# Altium schematic sheet Componets.SchDoc
size A3; SheetNumber: 11; SheetTotal: 11
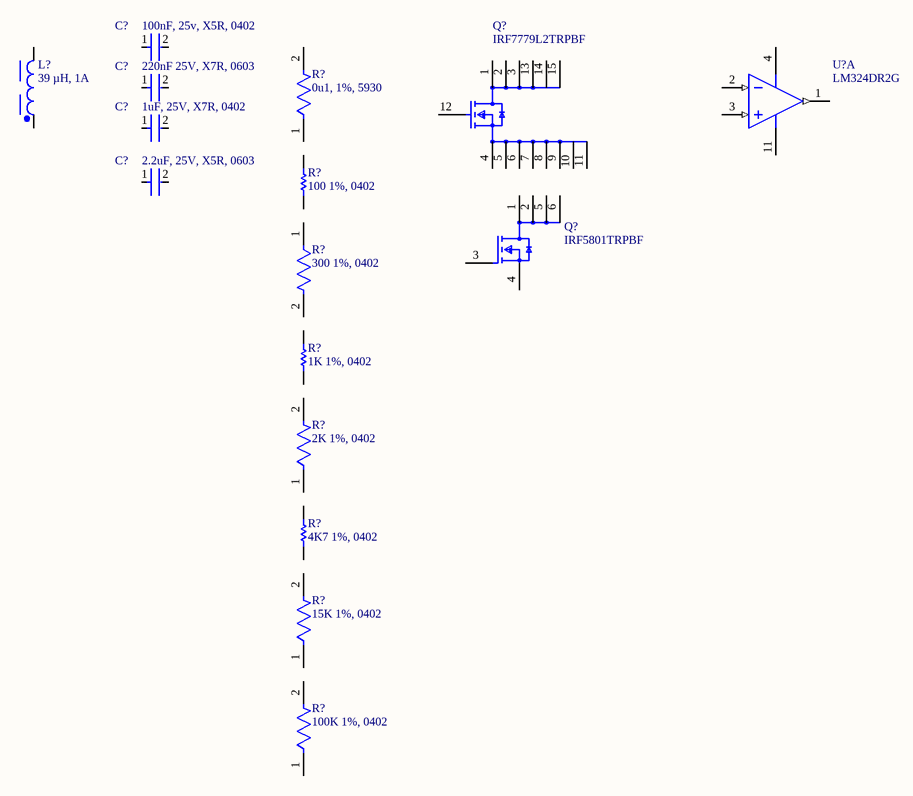
[diagram p0: Componets.SchDoc]

## Parts
(Parts that share a designator on the sheet are numbered #1, #2 ... from top to bottom, then left to right.)
C?#1  100nF, 25v, X5R, 0402  [FP-GRM155-0_05-IPC_C]
C?#2  220nF 25V, X7R, 0603  [FP-GCM188-0_1-IPC_B]
C?#3  1uF, 25V, X7R, 0402  [FP-GRM155-0_05-IPC_B]
C?#4  2.2uF, 25V, X5R, 0603  [FP-GRM188-0_1-e0_2_0_5-MFG]
L?  39 µH, 1A  [WE-PD_7345]
Q?#1  IRF7779L2TRPBF  [FP-MG-WDSON-11-MFG]
Q?#2  IRF5801TRPBF  [FP-PG-TSOP-6-MFG]
R?#1  0u1, 1%, 5930  [FP-CSS2H-5930K-1L00F-MFG]
R?#2  100 1%, 0402  [RESC1005X40X25LL05T05]
R?#3  300 1%, 0402  [FP-ERJ2RK-IPC_A]
R?#4  1K 1%, 0402  [RESC1005X40X25NL05T05]
R?#5  2K 1%, 0402  [FP-ERJ2RK-MFG]
R?#6  4K7 1%, 0402  [RESC1005X40X25LL05T05]
R?#7  15K 1%, 0402  [FP-ERJ2R-MFG]
R?#8  100K 1%, 0402  [FP-ERJ2RK-IPC_C]
U?  LM324DR2G  [ONSC-SOIC-14-751A-03_V]  (part A of 4)

## Nets

Not connected (* = marked no-connect by the designer): C?#1 1 2; C?#2 1 2; C?#3 1 2; C?#4 1 2; L? 1 2; Q?#1 1(Drain) 2(Drain) 3(Drain) 4(Source) 5(Source) 6(Source) 7(Source) 8(Source) 9(Source) 10(Source) 11(Source) 12(Gate) 13(Drain) 14(Drain) 15(Drain); Q?#2 1(D) 2(D) 3(G) 4(S) 5(D) 6(D); R?#1 1 2; R?#2 1 2; R?#3 1 2; R?#4 1 2; R?#5 1 2; R?#6 1 2; R?#7 1 2; R?#8 1 2; U? 1(OUT1) 2(IN1-) 3(IN1+) 4(VCC) 11(VEE/GND)

## Library data of the parts
C?#1 = CMP-06035-003661-1: Chip Multilayer Ceramic Capacitors for General Purpose, 0402, 0.10uF, X7R, 15%, 10%, 25V; Length: 1mm; Depth: 0.5mm; Dielectric: X7R; Voltage Rating: 25V; Lead Free: Lead Free; Case Code (Imperial): 0402; Voltage: 25V; Min Operating Temperature: -55°C; Tolerance: 10%; Dielectric Material: Ceramic; Voltage Rating (DC): 25V; Max Operating Temperature: 125°C; Capacitance: 100nF; Thickness: 0.022inch; Case/Package: 0402; Height: 0.5mm; Resistor Type: Ceramic; Weight: 0.000212oz; Case Code (Metric): 1005; Package Quantity: 10000; Termination: SMD/SMT; Width: 0.02inch; Mount: Surface Mount; Packaging: Tape and Reel
C?#2 = CMP-2006-02366-2: Ceramic Capacitor for Automotive 220nF  ±10% 25VDC X7R 0603 Paper T/R; Capacitance: 220nF; Mount: Surface Mount; Ratings: AEC-Q200; Case/Package: 0603; Packaging: Tape and Reel; Radiation Hardening: No; Voltage: 25V; Dielectric: X7R; Case Code (Imperial): 0603; Max Operating Temperature: 125°C; Min Operating Temperature: -55°C; Depth: 0.8mm; Termination: SMD/SMT; Package Quantity: 1; Case Code (Metric): 1608; Thickness: 0.035inch; Voltage Rating: 25V; Tolerance: 10%; Voltage Rating (DC): 25V; Height: 0.8mm; Lead Free: Lead Free; Length: 1.6mm; Width: 0.031inch
C?#3 = CMP-2008-04581-2: Chip Multilayer Ceramic Capacitors for General Purpose, 0402, 1.0uF, X5R, 15%, 10%, 25V; Height: 0.5mm; Voltage: 25V; Tolerance: 10%; Termination: SMD/SMT; Dielectric: X5R; REACH SVHC: No SVHC; Case Code (Imperial): 0402; Max Operating Temperature: 85°C; Lead Free: Lead Free; Case/Package: 0402; Mount: Surface Mount; Width: 0.5mm; Weight: 0.000212oz; Min Operating Temperature: -55°C; Voltage Rating (DC): 25V; Length: 1mm; Thickness: 0.022inch; Voltage Rating: 25V; Material: Ceramic; Case Code (Metric): 1005; Package Quantity: 10000; Packaging: Tape and Reel; Depth: 0.5mm; Capacitance: 1uF
C?#4 = CMP-2006-02820-2: Chip Multilayer Ceramic Capacitors for General Purpose, 0603, 2.2uF, X5R, 15%, 10%, 25V; Number of Pins: 2; Dielectric: X5R; Tolerance: 10%; Case Code (Imperial): 0603; Thickness: 0.035inch; Case/Package: 0603; Lead Free: Lead Free; Mount: Surface Mount; Material: Ceramic; Depth: 0.8mm; Voltage: 25V; Capacitance: 2.2uF; Min Operating Temperature: -55°C; Package Quantity: 4000; REACH SVHC: No SVHC; Resistor Type: Ceramic; Packaging: Tape and Reel; Case Code (Metric): 1608; Max Operating Temperature: 85°C; Width: 0.8mm; Termination: SMD/SMT; Voltage Rating: 25V; Length: 1.6mm; Voltage Rating (DC): 25V; Height: 0.8mm; Radiation Hardening: No; Weight: 0.000222oz
L? = CMP-0227-00153-2: NexarPartId: 29930417; Max DC Current: 1.11A; Shielding: Shielded; Inductance: 39µH; Self Resonant Frequency: 11MHz; DC Resistance (DCR): 145mΩ; Tolerance: 20%; Ambient Temperature Range Low: -40°C; Width: 7.3mm; Length: 7.3mm; Number of Pins: 2; Packaging: Tape & Reel; Height: 4.5mm; Ambient Temperature Range High: 85°C; Max Operating Temperature: 125°C; Depth: 7.3mm; Min Operating Temperature: -40°C; RoHS: Compliant; Current Rating: 1.11A
Q?#1 = CMP-32901-000937-1: MOSFET N-CH 150V 375A DIRECTFET; Drain to Source Resistance: 11mR; Power Dissipation: 125W; Turn-On Delay Time: 16ns; Threshold Voltage: 4V; Input Capacitance: 6.66nF; Turn-Off Delay Time: 36ns; Gate to Source Voltage (Vgs): 20V; Length: 0.36inch; Number of Pins: 11; Min Operating Temperature: -55°C; Halogen Free: Halogen Free; Rds On Max: 11mR; REACH SVHC: No SVHC; Max Operating Temperature: 175°C; Continuous Drain Current (ID): 375A; Max Power Dissipation: 125W; Mount: Surface Mount; Width: 0.28inch; Max Dual Supply Voltage: 150V; Lead Free: Lead Free; Height: 0.02inch; Series: HEXFET®; RoHS Compliant: Yes; Drain to Source Voltage (Vdss): 150V; Packaging: Cut Tape
Q?#2 = CMP-32901-001111-1: MOSFET N-CH 200V 600MA MICRO6; Turn-On Delay Time: 6.5ns; Power Dissipation: 2W; Rds On Max: 2.2R; Polarization: N; Input Capacitance: 88pF; Turn-Off Delay Time: 8.8ns; Threshold Voltage: 5.5V; Gate to Source Voltage (Vgs): 30V; Max Dual Supply Voltage: 200V; Mount: Surface Mount; Width: 0.067inch; RoHS Compliant: Yes; Series: HEXFET®; Packaging: Cut Tape; Drain to Source Breakdown Voltage: 200V; Length: 0.118inch; Height: 0.039inch; Number of Pins: 6; Case/Package: TSOP; Halogen Free: Halogen Free; Drain to Source Voltage (Vdss): 200V; Min Operating Temperature: -55°C; Reach SVHC Compliant: Yes; Max Operating Temperature: 150°C; Lead Free: Lead Free; Max Power Dissipation: 2W; Continuous Drain Current (ID): 600mA; Drain to Source Resistance: 2.2R
R?#1 = CMP-00059-73869598-1: CSS2H-5930K-1L00F Res Metal Strip 5930 0.001 Ohm 1% 9W ±50ppm/C Pad SMD Automotive T/R; Resistance: 1mΩ; Temperature Coefficient: 50ppm/°C; Case Code (Imperial): 5931; Width: 7.747mm; Min Operating Temperature: -55°C; Tolerance: 1%; Max Power Dissipation: 9W; Case Code (Metric): 1577; Max Operating Temperature: 170°C; NexarPartId: 73869598; Power Rating: 9W; Composition: Metal Element; Case/Package: 5930; Height: 939.8µm; Number of Terminations: 2; Schedule B: 8533210045, 8533210045; Packaging: Cut Tape; REACH SVHC: No SVHC; Features: Moisture Resistant; RoHS: Compliant; Length: 15.0114mm
R?#2 = CMP-2002-00605-3: Chip Resistor, 100 Ohm, +/- 1%, 100 mW, -55 to 155 degC, 0402 (1005 Metric), RoHS, Tape and Reel; Manufacturer: Basic Passives; PartNumber: ERJ-2RKF1000X; Power Rating: 100 mW; Resistance: 100 Ohm; Voltage Rating: 50 V; Case\/Package: 0402; Width: 0.5 mm; Pins: 2; ComponentLink2Description: Datasheet; PackageReference: 0402; Height: 0.35 mm; Tolerance: 1%; DatasheetVersion: 04/2015; Case Code (Imperial): 0402; Min Operating Temperature: -55 degC; Radiation Hardening: No; Length: 1 mm; Package Quantity: 10000; PackageDescription: 2-Pin Surface Mount Device, Body 1 x 0.5 mm; Mounting Technology: Surface Mount; Case Code (Metric): 1005; Packaging: Tape and Reel; ComponentLink1URL: http://www.panasonic.com/; RoHSCompliant: true; Max Operating Temperature: 155 degC; REACH SVHC: Yes; ComponentLink1Description: Manufacturer URL; ComponentLink2URL: http://industrial.panasonic.com/cdbs/www-data/pdf/RDA0000/AOA0000C86.pdf; Mount: Surface Mount
R?#3 = CMP-1011-00449-3: RES SMD 300 OHM 1% 1/10W 0402; Power Rating: 100mW; Voltage Rating: 50V; Temperature Coefficient: 100ppm/°C; Resistance: 300R; Case Code (Imperial): 0402; Termination: SMD/SMT; REACH SVHC: No SVHC; Number of Terminations: 2; Composition: Thick Film; Case Code (Metric): 1005; Voltage Rating (DC): 50V; Packaging: Tape and Reel; Max Power Dissipation: 100mW; Tolerance: 1%; Lead Free: Lead Free; Military Standard: Not; Mount: Surface Mount; Height: 0.35mm; Package Quantity: 10000; Max Operating Temperature: 155°C; Depth: 0.5mm; Min Operating Temperature: -55°C; Length: 1mm; Contact Plating: Tin; Width: 0.02inch; Case/Package: 0402
R?#4 = CMP-1011-00510-4: Chip Resistor, 1 KOhm, +/- 1%, 100 mW, -55 to 155 degC, 0402 (1005 Metric), RoHS, Tape and Reel; PartNumber: ERJ-2RKF1001X; Manufacturer: Basic Passives; Voltage Rating: 50 V; Case\/Package: 0402; Resistance: 1 KOhm; Power Rating: 100 mW; DatasheetVersion: 04/2015; Radiation Hardening: No; Pins: 2; Height: 0.35 mm; RoHSCompliant: true; Case Code (Imperial): 0402; ComponentLink2Description: Datasheet; ComponentLink1Description: Manufacturer URL; PackageReference: 0402; Mount: Surface Mount; Package Quantity: 10000; Tolerance: 1%; ComponentLink1URL: http://www.panasonic.com/; PackageDescription: 2-Pin Surface Mount Device, Body 1 x 0.5 mm; Mounting Technology: Surface Mount; Case Code (Metric): 1005; ComponentLink2URL: http://industrial.panasonic.com/cdbs/www-data/pdf/RDA0000/AOA0000C86.pdf; REACH SVHC: Yes; Packaging: Tape and Reel; Max Operating Temperature: 155 degC; Min Operating Temperature: -55 degC; Width: 0.5 mm; Length: 1 mm
R?#5 = CMP-2002-00758-4: RES SMD 2K OHM 1% 1/10W 0402; Temperature Coefficient: 100ppm/°C; Max Power Dissipation: 100mW; Working Voltage: 50V; Resistance: 2kR; Number of Terminations: 2; Technology: THICK FILM; Packaging: Tape and Reel; RoHS Compliant: Yes; Min Operating Temperature: -55°C; Length: 1mm; Construction: Rectangular; Features: Automotive AEC-Q200; Contact Plating: Tin; Lead Free: Lead Free; Series: ERJ; Power Rating: 100mW; REACH SVHC: No SVHC; Resistor Type: Thick Film; Max Operating Temperature: 155°C; Package Quantity: 10000; Height: 0.35mm; Case/Package: 0402; Tolerance: 1%; Mount: Surface Mount; Termination: SMD/SMT; Resistance Tolerance: 1%; Depth: 0.5mm; Voltage Rating (DC): 50V; Voltage Rating: 50V; Case Code (Imperial): 0402; Military Standard: Not; Width: 0.02inch; Radiation Hardening: No; Case Code (Metric): 1005
R?#6 = CMP-2002-01154-4: Chip Resistor, 4.7 KOhm, +/- 1%, 0.1 W, -55 to 155 degC, 0402 (1005 Metric), RoHS, Tape and Reel; PartNumber: ERJ-2RKF4701X; Voltage Rating: 50 V; Case\/Package: 0402; Power Rating: 100 mW; Height: 0.35 mm; Mounting Technology: Surface Mount; REACH SVHC: Yes; Resistance: 4.7 KOhm; Max Operating Temperature: 155 degC; ComponentLink1Description: Manufacturer URL; ComponentLink2Description: Datasheet; Pins: 2; PackageReference: 0402; Tolerance: 1%; Case Code (Imperial): 0402; Length: 1 mm; PackageDescription: 2-Pin Surface Mount Device, Body 1 x 0.5 mm; RoHSCompliant: true; Package Quantity: 1; Radiation Hardening: No; DatasheetVersion: 04/2015; Width: 0.5 mm; Case Code (Metric): 1005; Mount: Surface Mount; ComponentLink1URL: http://www.panasonic.com/; Min Operating Temperature: -55 degC; Packaging: Cut Tape; ComponentLink2URL: http://industrial.panasonic.com/cdbs/www-data/pdf/RDA0000/AOA0000C86.pdf
R?#7 = CMP-2002-00694-4: RES SMD 15K OHM 1% 1/10W 0402; Manufacturer Part Number: ERJ-2RKF1502X; Manufacturer: Panasonic; Automotive Grade: Grade 0; Voltage Rating: 50V; Resistance: 15kΩ; Temperature Coefficient: 100ppm/°C; Power Rating: 0.1W; Value: 15kΩ; ComponentLink2URL: https://industrial.panasonic.com/cdbs/www-data/pdf/RDA0000/AOA0000C304.pdf; Automotive: Yes; Temperature: -55°C to +155°C; Height: 0.4mm; Digikey Description: RES SMD 15K OHM 1% 1/10W 0402; Category: Res; Device Class L2: Resistors; Device Class L1: Passive Components; Package: ERJ2R; Temperature Range Low: -55°C; Tolerance: 1%; Series: ERJ; Footprint Url: https://b2b-api.panasonic.eu/file_stream/pids/fileversion/1180; Mouser Description: Res Thick Film 1.0 x 0.5 mm 15K Ohm 1% 0.1W(1/10W) 100ppm/ C Molded SMD Punched Carrier T/R; Composition: Thick Film; Lead Free: Yes; Device Class L3: Chip SMD Resistors; Octopart: https://octopart.com/erj-2rkf1502x-panasonic-55404985; RoHS: TRUE; Temperature Range High: +155°C; ComponentLink2Description: Datasheet
R?#8 = CMP-2002-00608-4: RES SMD 100K OHM 1% 1/10W 0402; Resistance: 100kR; Voltage Rating (DC): 50V; Power Rating: 100mW; Temperature Coefficient: 100ppm/°C; Case/Package: 0402; Length: 1mm; Package Quantity: 1; Radiation Hardening: No; Case Code (Metric): 1005; Contact Plating: Tin; Mount: Surface Mount; Depth: 0.5mm; Max Operating Temperature: 155°C; Lead Free: Lead Free; Width: 0.5mm; Composition: Thick Film; Case Code (Imperial): 0402; Tolerance: 1%; Termination: SMD/SMT; Number of Pins: 2; Height: 0.35mm; Voltage Rating: 50V; Military Standard: Not; REACH SVHC: No SVHC; Packaging: Tape and Reel; Min Operating Temperature: -55°C; Max Power Dissipation: 100mW; Features: Automotive AEC-Q200; Number of Terminations: 2
U? = CMP-1310-00171-1: Single Supply Quad Operational Amplifier, 3 to 32 V, 0 to 70 degC, 14-Pin SOIC, Pb-Free, Tape and Reel; Manufacturer: On Semiconductor; VCC Max (V): 32; VCC Min (V): 3; PackageVersion: Rev. K, 05/2011; ComponentLink3URL: http://www.onsemi.com/pub_link/Collateral/751A-03.PDF; ComponentLink3Description: Package Specification; Packing: Tape and Reel; ComponentLink2URL: http://www.onsemi.cn/pub_link/Collateral/LM324-D.PDF; PackageReference: SOIC-14-751A-03; ComponentLink1URL: http://www.onsemi.com/; PackageDescription: 14-Pin Small Outline Integrated Circuit, Body 8.65 x 3.9 mm, Pitch 1.27 mm; ComponentLink1Description: Manufacturer URL; DatasheetVersion: Rev. 25; Mounting Technology: Surface Mount; RoHS: TRUE; ComponentLink2Description: Datasheet; PartNumber: LM324DR2G